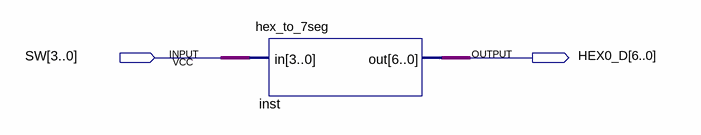
[diagram p0: schematic sheet]
// Quartus schematic Ex2a.bdf as structural Verilog: 1 symbols, 2 pins
module Ex2a (
  input  [3:0] SW,
  output [6:0] HEX0_D
);

  hex_to_7seg inst (.in(SW), .out(HEX0_D));
endmodule
